# EasyEDA Pro project ProProject_Tautek_ESP32S3_2024-01-15.epro, schematic Schematic2
Create Date: 2024-01-02; Page Name: P1; Project Name: Tautek_ESP32S3; Schematic Name: Schematic2; Update Date: 2024-01-14; Company: EasyEDA.com; Drawed: EasyEDA Pro; Page Size: A4; Part Number: JLCPCB-002; Reviewed: EasyEDA Pro; Version: V0.1
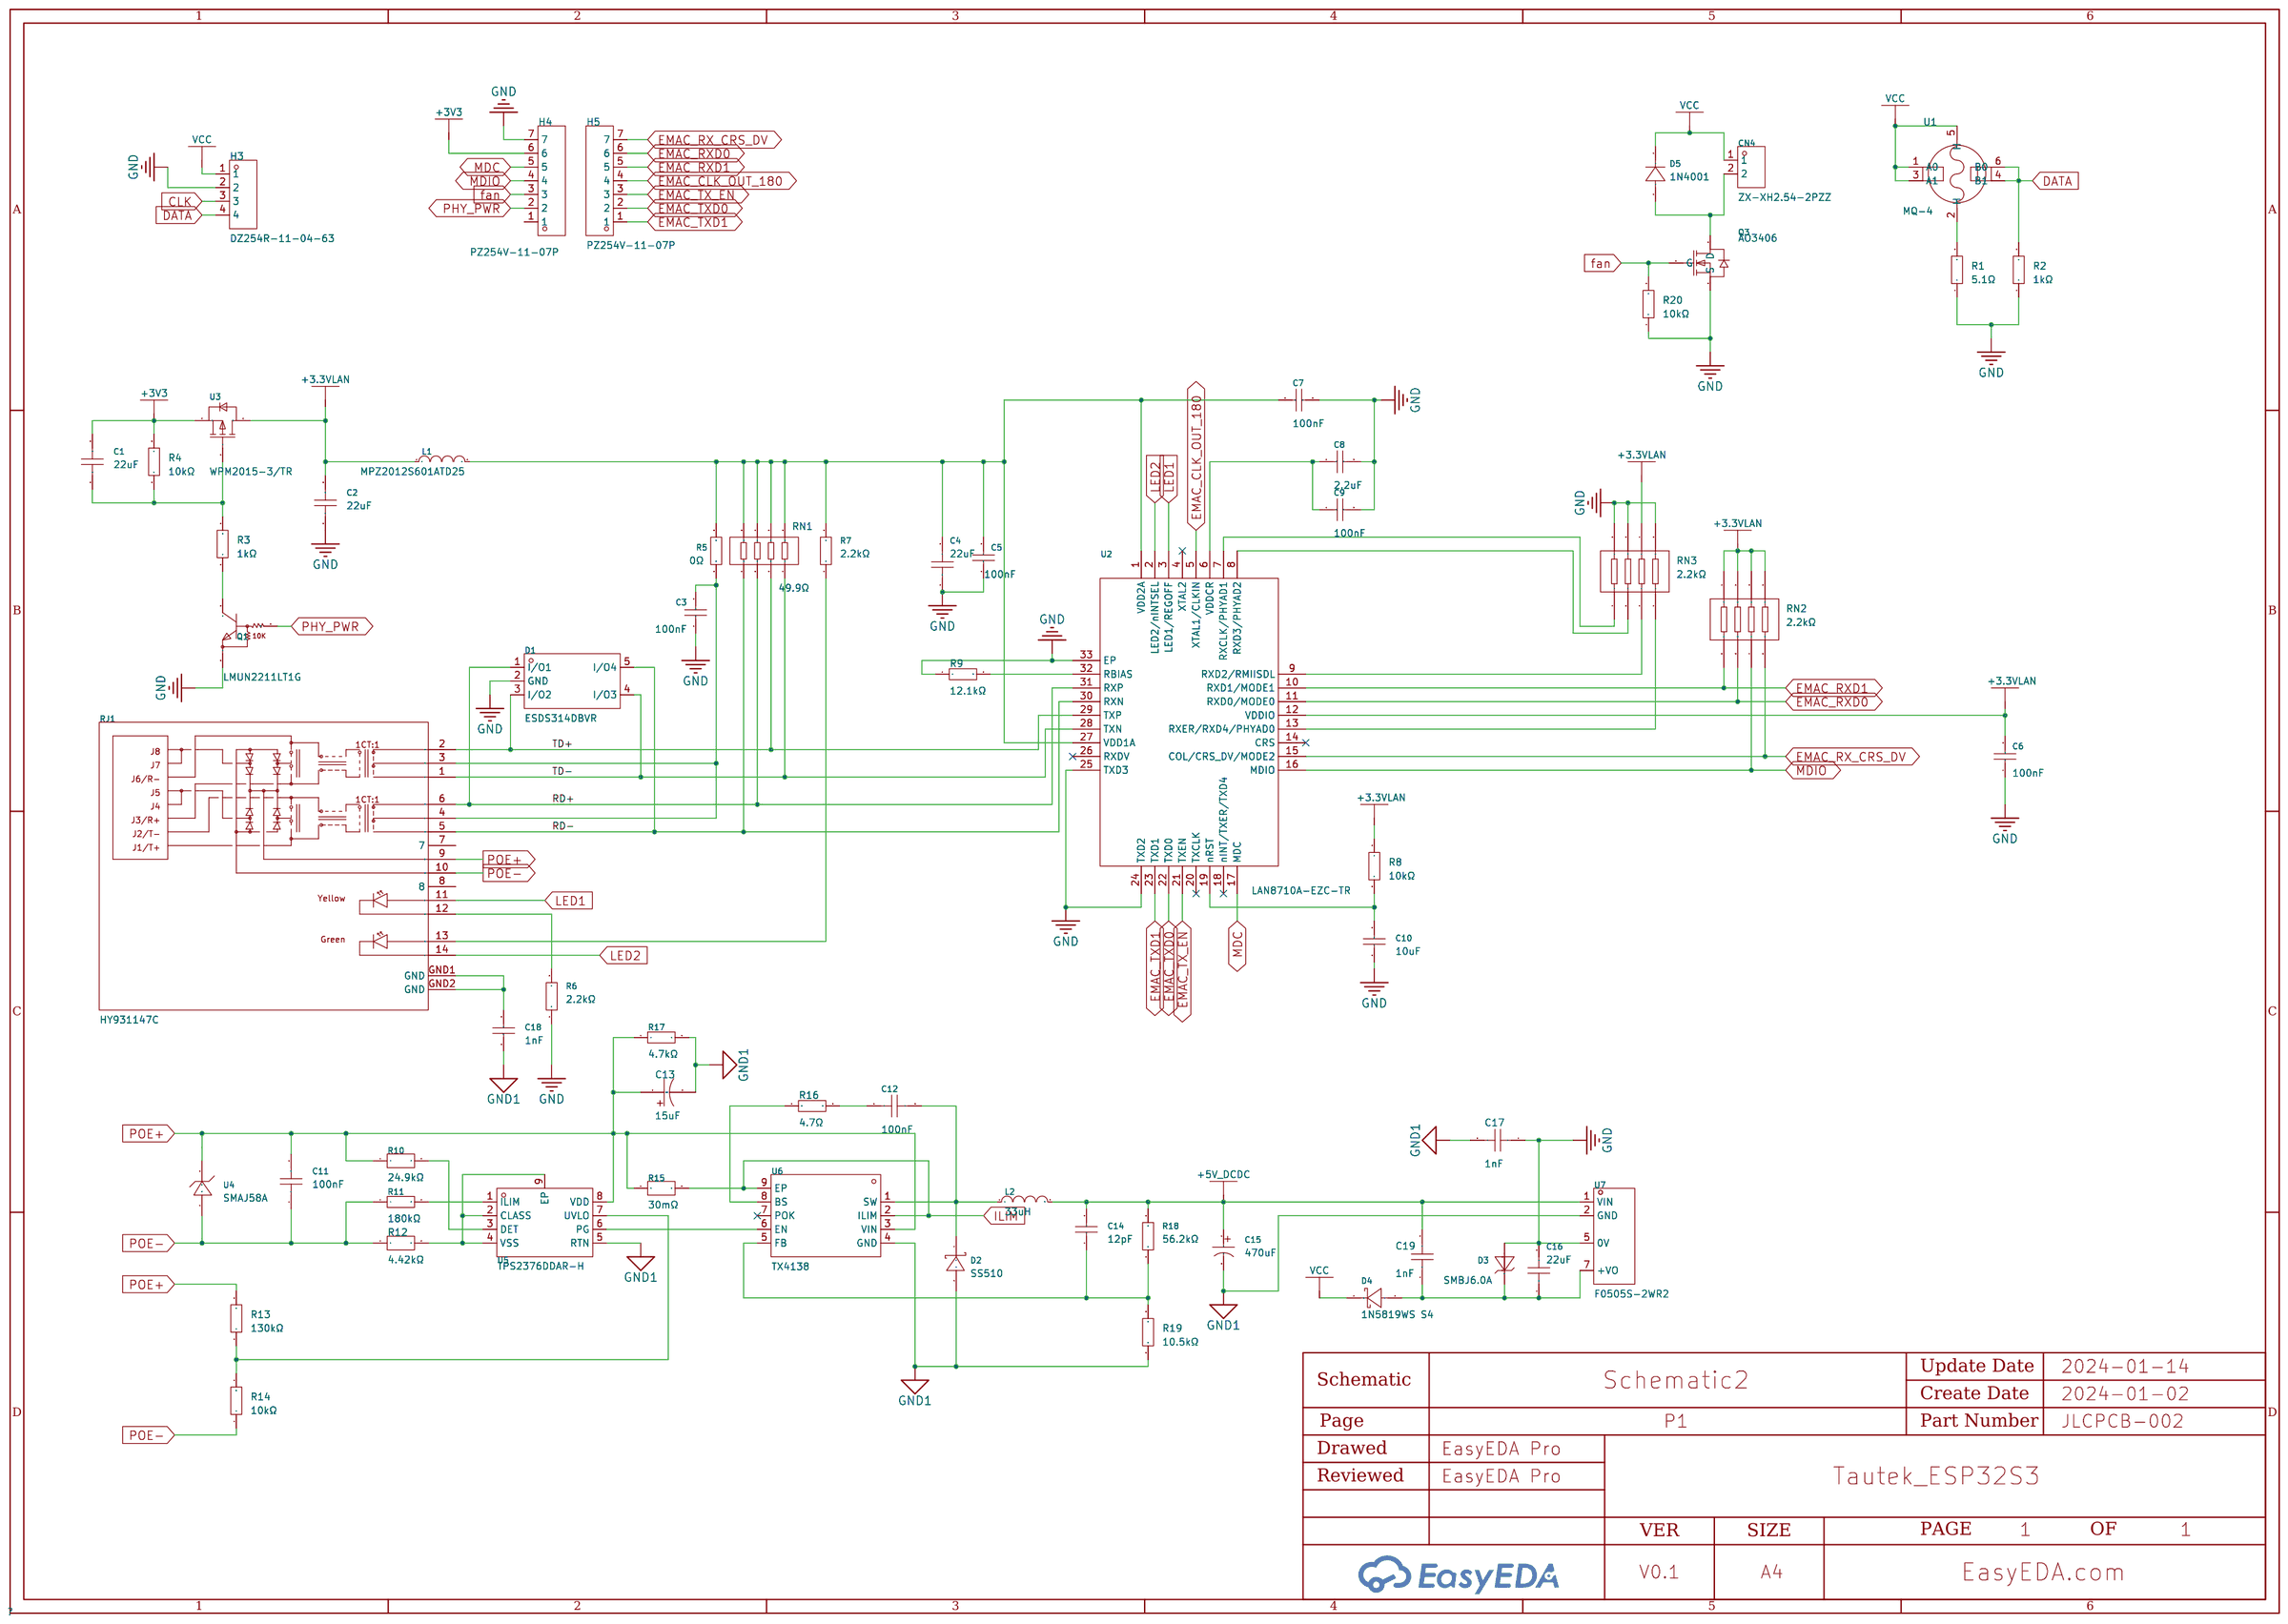
[diagram p0: schematic sheet]

## Parts
C1  22uF  [C0603]
C2  22uF  [C0603]
C3  100nF  [C0402]
C4  22uF  [C0603]
C5  100nF  [C0402]
C6  100nF  [C0402]
C7  100nF  [C0402]
C8  2.2uF  [C0603]
C9  100nF  [C0402]
C10  10uF  [C0402]
C11  100nF  [C0603]
C12  100nF  [C0603]
C13  15uF  [CAP-TH_BD5.0-P2.00-D0.8-FD]
C14  12pF  [C0402]
C15  470uF  [CAP-TH_BD6.3-P2.50-D1.0-FD]
C16  22uF  [C0603]
C17  1nF  [C1808]
C18  1nF  [C1206]
C19  1nF  [C1808]
CN4  ZX-XH2.54-2PZZ  [CONN-TH_2P-P2.50_HX25003-2A]
D1  ESDS314DBVR  [SOT-23-5_L2.9-W1.6-P0.95-LS2.8-BL]
D2  SS510  [SMA_L4.3-W2.6-LS5.2-RD]
D3  SMBJ6.0A  [SMB_L4.5-W3.7-LS5.4-RD]
D4  1N5819WS S4  [SOD-323_L1.6-W1.3-LS2.7-RD]
D5  1N4001  [SMA_L4.3-W2.5-LS5.0-RD]
H3  DZ254R-11-04-63  [HDR-TH_4P-P2.54-V-M]
H4  PZ254V-11-07P  [HDR-TH_7P-P2.54-V-M]
H5  PZ254V-11-07P  [HDR-TH_7P-P2.54-V-M]
L1  MPZ2012S601ATD25  [L0805]
L2  33uH  [IND-SMD_L8.0-W8.0]
Q1  LMUN2211LT1G  [SOT-23-3_L2.9-W1.3-P1.90-LS2.4-BR]
Q3  AO3406  [SOT-23-3L_L2.9-W1.6-P1.90-LS2.8-BL]
R1  5.1Ω  [R0805]
R2  1kΩ  [R0603]
R3  1kΩ  [R0402]
R4  10kΩ  [R0402]
R5  0Ω  [R0402]
R6  2.2kΩ  [R0402]
R7  2.2kΩ  [R0402]
R8  10kΩ  [R0402]
R9  12.1kΩ  [R0402]
R10  24.9kΩ  [R0603]
R11  180kΩ  [R0603]
R12  4.42kΩ  [R0603]
R13  130kΩ  [R0603]
R14  10kΩ  [R0603]
R15  30mΩ  [R1206]
R16  4.7Ω  [R0402]
R17  4.7kΩ  [R2512]
R18  56.2kΩ  [R0402]
R19  10.5kΩ  [R0402]
R20  10kΩ  [R0402]
RJ1  HY931147C  [RJ45-TH_HY931147C]
RN1  49.9Ω  [RES-ARRAY-SMD_0603-8P-L3.2-W1.6-BL]
RN2  2.2kΩ  [RES-ARRAY-SMD_8P-L3.2-W1.6-P0.80-BL-2]
RN3  2.2kΩ  [RES-ARRAY-SMD_8P-L3.2-W1.6-P0.80-BL-2]
U1  MQ-4  [SENSOR-TH_MQ-4]
U2  LAN8710A-EZC-TR  [QFN-32_L5.0-W5.0-P0.50-BL-EP3.4]
U3  WPM2015-3/TR  [SOT-23-3_L2.9-W1.3-P1.90-LS2.4-BR]
U4  SMAJ58A  [SMA_L4.3-W2.7-LS5.0-RD]
U5  TPS2376DDAR-H  [SO-8_L4.9-W3.9-P1.27-LS6.0-BL-EP]
U6  TX4138  [SOIC-8_L4.9-W3.9-P1.27-LS6.0-BL-EP]
U7  F0505S-2WR2  [PWRM-TH_FXXXXS-1WR2]

## Library data of the parts
C1 C2 C4 C16 = CL10A226MQ8NRNC: Capacitance: Tolerance:±20% Tolerance:±20% Voltage Rated: Temperature Coefficient:; LCSC Part Name: 22uF ±20% 6.3V; Supplier Part: C59461; Manufacturer: SAMSUNG(三星); Supplier Footprint: 0603; JLCPCB Part Class: Basic Part; Datasheet: https://atta.szlcsc.com/upload/public/pdf/source/20160218/1457707763339.pdf; Supplier: LCSC; Tolerance: ±20%
C3 C5-C7 C9 = CL05B104KO5NNNC: Capacitance: Tolerance:±10% Tolerance:±10% Voltage Rated: Temperature Coefficient:; LCSC Part Name: 100nF ±10% 16V; Supplier Part: C1525; Manufacturer: SAMSUNG(三星); Supplier Footprint: 0402; JLCPCB Part Class: Basic Part; Datasheet: https://atta.szlcsc.com/upload/public/pdf/source/20160218/1457707763339.pdf; Supplier: LCSC; Tolerance: ±10%
C8 = CL10A225KO8NNNC: Capacitance: Tolerance:±10% Tolerance:±10% Voltage Rated: Temperature Coefficient:; LCSC Part Name: 2.2uF ±10% 16V; Supplier Part: C23630; Manufacturer: SAMSUNG(三星); Supplier Footprint: 0603; JLCPCB Part Class: Basic Part; Datasheet: https://atta.szlcsc.com/upload/public/pdf/source/20160218/1457707763339.pdf; Supplier: LCSC; Tolerance: ±10%
C10 = CL05A106MQ5NUNC: Capacitance: Tolerance:±20% Tolerance:±20% Voltage Rated: Temperature Coefficient:; LCSC Part Name: 10uF ±20% 6.3V; Supplier Part: C15525; Manufacturer: SAMSUNG(三星); Supplier Footprint: 0402; JLCPCB Part Class: Basic Part; Datasheet: https://atta.szlcsc.com/upload/public/pdf/source/20220823/2B02EE04F8F211D38A52DCB16EB6BEBA.pdf; Supplier: LCSC; Tolerance: ±20%
C11 = CL10B104KC8NNNC: Capacitance: Tolerance:±10% Tolerance:±10% Voltage Rated: Temperature Coefficient:; LCSC Part Name: 100nF ±10% 100V; Supplier Part: C15725; Manufacturer: SAMSUNG(三星); Supplier Footprint: 0603; JLCPCB Part Class: Extended Part; Datasheet: https://atta.szlcsc.com/upload/public/pdf/source/20160218/1457707763339.pdf; Supplier: LCSC; Tolerance: ±10%
C12 = AC0603KRX7R0BB104: Capacitance: Tolerance:±10% Tolerance:±10% Voltage Rated: Temperature Coefficient:; LCSC Part Name: 100nF ±10% 100V; Supplier Part: C408909; Manufacturer: YAGEO(国巨); Supplier Footprint: 0603; JLCPCB Part Class: Extended Part; Datasheet: https://atta.szlcsc.com/upload/public/pdf/source/20190807/C408909_08D926EAD6CFF180A2920270A6C9C818.pdf; Supplier: LCSC; Tolerance: ±10%
C13 = LKMB1102A150MF: Capacitance: Tolerance:±20% Tolerance:±20% Rated Voltage: φD: L: Lead Spacing: Ripple Current:267mA@100kHz Equivalent Series Resistance(ESR):- Lifetime @ Temp:7000hrs@105℃; LCSC Part Name: 15uF ±20% 100V; Supplier Part: C443117; Manufacturer: Ymin(永铭); Supplier Footprint: 插件,D5xL11mm; JLCPCB Part Class: Extended Part; Datasheet: https://atta.szlcsc.com/upload/public/pdf/source/20191107/C443117_345849A2C5892D7759BB73F011F8AA70.pdf; Supplier: LCSC; Tolerance: ±20%; Ripple Current: 267mA@100kHz; Lifetime @ Temp: 7000hrs@105℃
C14 = GRM1555C1H120JA01D: Capacitance: Tolerance:±5% Tolerance:±5% Voltage Rated: Temperature Coefficient:; LCSC Part Name: 12pF ±5% 50V; Supplier Part: C76948; Manufacturer: muRata(村田); Supplier Footprint: 0402; JLCPCB Part Class: Extended Part; Datasheet: https://atta.szlcsc.com/upload/public/pdf/source/20180307/C76948_15204091175261407736.pdf; Supplier: LCSC; Tolerance: ±5%
C15 = KM477M010E11RR0VH2FP0: Capacitance: Tolerance:±20% Tolerance:±20% Rated Voltage: φD: L: Lead Spacing: Lifetime @ Temp:1000hrs@105℃; LCSC Part Name: 470uF ±20% 10V; Supplier Part: C43326; Manufacturer: CX(承兴); Supplier Footprint: 插件,D6.3xL11mm; JLCPCB Part Class: Extended Part; Datasheet: https://atta.szlcsc.com/upload/public/pdf/source/20211027/06D6BA3719C264B639DC286D935D03EA.pdf; Supplier: LCSC; Tolerance: ±20%; Lifetime @ Temp: 1000hrs@105℃
C17 C19 = 302R29W102KV4E: Capacitance: Tolerance:±10% Tolerance:±10% Voltage Rated: Temperature Coefficient:; LCSC Part Name: 1nF ±10% 3kV; Supplier Part: C173224; Manufacturer: JOHANSON(约翰逊); Supplier Footprint: 1808; JLCPCB Part Class: Extended Part; Datasheet: https://atta.szlcsc.com/upload/public/pdf/source/20190909/C173224_EDDECDD913CC2D53A62E7AE6E78D1950.pdf; Supplier: LCSC; Tolerance: ±10%
C18 = CC1206KKX7RDBB102: Capacitance: Tolerance:±10% Tolerance:±10% Voltage Rated: Temperature Coefficient:; LCSC Part Name: 1nF ±10% 2kV; Supplier Part: C23631; Manufacturer: YAGEO(国巨); Supplier Footprint: 1206; JLCPCB Part Class: Extended Part; Datasheet: https://atta.szlcsc.com/upload/public/pdf/source/20180910/C282080_BCE296114B59C3710FB69343383A5C6E.pdf; Supplier: LCSC; Tolerance: ±10%
CN4 = ZX-XH2.54-2PZZ: Pins Structure:1x2P Pitch:2.54mm Mounting Style:Straight Row Spacing:- Number of Pins:2P Number of Rows:1 Number of PINs Per Row:2 Reference Series:XH Current Rating (Max):3A Contact Material:Brass Contact Plating:Tin Operating Temperature Range:-25℃~+85℃; LCSC Part Name: 1x2P 间距:2.54mm 直插 系列:XH; Supplier Part: C7429632; Manufacturer: Megastar(兆星); Supplier Footprint: 插件,P=2.54mm; JLCPCB Part Class: Extended Part; Datasheet: https://atta.szlcsc.com/upload/public/pdf/source/20230619/19BA6947230AA44A04D3EDD65E618FD0.pdf; Supplier: LCSC; Pins Structure: 1x2P; Pitch: 2.54mm; Mounting Style: Straight; Number of Pins: 2P; Number of Rows: 1; Number of PINs Per Row: 2; Reference Series: XH; Current Rating (Max): 3A; Contact Material: Brass; Contact Plating: Tin; Operating Temperature Range: -25℃~+85℃
D1 = ESDS314DBVR: Supplier Part: C1847859; Manufacturer: TI(德州仪器); Supplier Footprint: SOT-23-5; JLCPCB Part Class: Extended Part; Datasheet: https://www.ti.com/cn/lit/gpn/esds314; Supplier: LCSC
D2 = SS510_C65010: Forward Voltage (Vf@If):850mV@5A Reverse Voltage (Vr):100V Average Rectified Current (Io):5A; LCSC Part Name: 电压:100V 电流:5A; Supplier Part: C65010; Manufacturer: MDD; Supplier Footprint: SMA(DO-214AC); JLCPCB Part Class: Extended Part; Datasheet: https://atta.szlcsc.com/upload/public/pdf/source/20230314/529CD85F9B31F69841D3A079BC07E377.pdf; Supplier: LCSC; Forward Voltage (Vf@If): 850mV@5A; Reverse Voltage (Vr): 100V; Average Rectified Current (Io): 5A
D3 = SMBJ6.0A_C908784: Reverse Stand-Off Voltage (Vrwm):6V Maximum Clamping Voltage:10.3V Peak Pulse Current (Ipp)@10/1000us:58.3A Breakdown Voltage:6.67V Reverse Leakage Current (Ir):800uA; Supplier Part: C908784; Manufacturer: GOODWORK(固得沃克); Supplier Footprint: SMB(DO-214AA); JLCPCB Part Class: Extended Part; Datasheet: https://atta.szlcsc.com/upload/public/pdf/source/20201231/C908783_5F0AE07776753216FC0A4122EEBBB8E2.pdf; Supplier: LCSC; Reverse Stand-Off Voltage (Vrwm): 6V; Maximum Clamping Voltage: 10.3V; Peak Pulse Current (Ipp)@10/1000us: 58.3A; Breakdown Voltage: 6.67V; Reverse Leakage Current (Ir): 800uA
D4 = 1N5819WS S4_C2927280: Diode Configuration:Single Forward Voltage (Vf@If):600mV@200mA Reverse Voltage (Vr):40V Average Rectified Current (Io):350mA Reverse Leakage Current (Ir):5uA@30V; LCSC Part Name: 电压:40V 电流:350mA; Supplier Part: C2927280; Manufacturer: JSMSEMI(杰盛微); Supplier Footprint: SOD-323; JLCPCB Part Class: Extended Part; Datasheet: https://atta.szlcsc.com/upload/public/pdf/source/20211230/020DF3ABCB41CBA5E28580D63AFB2CA3.pdf; Supplier: LCSC; Diode Configuration: Single; Forward Voltage (Vf@If): 600mV@200mA; Reverse Voltage (Vr): 40V; Average Rectified Current (Io): 350mA; Reverse Leakage Current (Ir): 5uA@30V
D5 = 1N4001_C727079: Diode Configuration: Forward Voltage (Vf@If):1.1V@1A Reverse Voltage (Vr): Average Rectified Current (Io): Reverse Leakage Current:5uA@50V; LCSC Part Name: 电压:50V 电流:1A; Supplier Part: C727079; Manufacturer: TWGMC(台湾迪嘉); Supplier Footprint: SMA(DO-214AC); JLCPCB Part Class: Extended Part; Datasheet: https://atta.szlcsc.com/upload/public/pdf/source/20200828/C727079_3A05254382567072883400655AE0ED46.pdf; Supplier: LCSC; Forward Voltage (Vf@If): 1.1V@1A; Reverse Leakage Current: 5uA@50V
H3 = DZ254R-11-04-63: Number of Rows:Plugin Number of Pins:4P Pitch:2.54mm Pin Structure:1x4P Row Spacing:- Mounting Type:Straight Circluar Pins/Square Pins:Square Pins Current Rating (Max):3A Voltage Rating (Max):- Length of Mating Pin:6mm Insulation Height:2.54mm Length of E; LCSC Part Name: 2.54mm 1x4P 直插 方针; Supplier Part: C2935910; Manufacturer: DEALON(德艺隆); Supplier Footprint: 插件,P=2.54mm; JLCPCB Part Class: Extended Part; Datasheet: https://atta.szlcsc.com/upload/public/pdf/source/20211231/575FA3133C71038A037ABECAE7869EE6.pdf; Supplier: LCSC; Number of Rows: Plugin; Number of Pins: 4P; Pitch: 2.54mm; Pin Structure: 1x4P; Mounting Type: Straight; Circluar Pins/Square Pins: Square Pins; Current Rating (Max): 3A; Length of Mating Pin: 6mm; Insulation Height: 2.54mm; Length of End Connection Pin: 3mm
H4 H5 = PZ254V-11-07P: Number of Rows:Plugin Number of Pins:7P Pitch:2.54mm Pin Structure:1x7P Row Spacing:- Mounting Type:Straight Circluar Pins/Square Pins:Square Pins Current Rating (Max):- Voltage Rating (Max):- Length of Mating Pin:6mm Insulation Height:2.5mm Length of End; LCSC Part Name: 2.54mm 1x7P 直插 方针; Supplier Part: C492406; Manufacturer: XFCN(兴飞); Supplier Footprint: 插件,P=2.54mm; JLCPCB Part Class: Extended Part; Datasheet: https://atta.szlcsc.com/upload/public/pdf/source/20200309/C492406_654C533EE691117E22DD9F76C114C2D9.pdf; Supplier: LCSC; Number of Rows: Plugin; Number of Pins: 7P; Pitch: 2.54mm; Pin Structure: 1x7P; Mounting Type: Straight; Circluar Pins/Square Pins: Square Pins; Length of Mating Pin: 6mm; Insulation Height: 2.5mm; Length of End Connection Pin: 3mm; Operating Temperature Range: -40℃~+105℃; Color: Black
L1 = MPZ2012S601ATD25: Impedance @ Frequency:600Ω@100MHz Tolerance:±25% Tolerance:±25% DC Resistance:100mΩ Current Rating:2A Circuits:1; LCSC Part Name: 单路 0805磁珠 阻抗600Ω@100MHz; Supplier Part: C81034; Manufacturer: TDK; Supplier Footprint: 0805; JLCPCB Part Class: Extended Part; Datasheet: https://atta.szlcsc.com/upload/public/pdf/source/20180613/C81034_2FD391D3901DD38A3F2C22B18566951A.pdf; Supplier: LCSC; Impedance @ Frequency: 600Ω@100MHz; Tolerance: ±25%; DC Resistance: 100mΩ; Current Rating: 2A; Circuits: 1
L2 = HPC8040NF-330M: Inductance: Tolerance:±20% Tolerance:±20% Rated Current: DC Resistance (DCR):; LCSC Part Name: 33uH ±20%; Supplier Part: C357084; Manufacturer: TAI-TECH(台庆); Supplier Footprint: SMD; JLCPCB Part Class: Extended Part; Datasheet: https://atta.szlcsc.com/upload/public/pdf/source/20200917/C357084_D822CFB55683CCA480E447E6A4B098EC.pdf; Supplier: LCSC; Tolerance: ±20%
Q1 = LMUN2211LT1G: Power Dissipation (Pd):246mW Collector-Emitter Breakdown Voltage (Vceo):50V Transistor Type:1个NPN-预偏置 Collector Current (Ic):100mA; LCSC Part Name: 电流:100mA 耐压:50V; Supplier Part: C12775; Manufacturer: LRC(乐山无线电); Supplier Footprint: SOT-23; JLCPCB Part Class: Extended Part; Datasheet: https://atta.szlcsc.com/upload/public/pdf/source/20130524/1457706604539.pdf; Supplier: LCSC; Power Dissipation (Pd): 246mW; Collector-Emitter Breakdown Voltage (Vceo): 50V; Transistor Type: 1个NPN-预偏置; Collector Current (Ic): 100mA
Q3 = AO3406: Type: Drain Source Voltage (Vdss): Continuous Drain Current (Id): Power Dissipation (Pd): Drain Source On Resistance (RDS(on)@Vgs,Id):40mΩ@10V,3.5A Gate Threshold Voltage (Vgs(th)@Id):3V@250uA Total Gate Charge (Qg@Vgs):3nC@4.5V Input Capacitance (Ciss@Vd; LCSC Part Name: N沟道 耐压:30V 电流:3.5A; Supplier Part: C2909910; Manufacturer: KUU; Supplier Footprint: SOT-23-3L; JLCPCB Part Class: Extended Part; Datasheet: https://atta.szlcsc.com/upload/public/pdf/source/20211028/0E3B3988D844BD6EE10576588A9F97BD.pdf; Supplier: LCSC; Drain Source On Resistance (RDS(on)@Vgs,Id): 40mΩ@10V,3.5A; Gate Threshold Voltage (Vgs(th)@Id): 3V@250uA; Total Gate Charge (Qg@Vgs): 3nC@4.5V; Input Capacitance (Ciss@Vds): 305pF@15V; Reverse Transfer Capacitance (Crss@Vds): 29pF@15V
R1 = RC0805FR-075R1L: Tolerance: Temperature Coefficient: Temperature Coefficient: Resistance: Power(Watts): Overload Voltage (Max): Operating Temperature Range: Operating Temperature Range:; LCSC Part Name: 5.1Ω ±1%; Supplier Part: C114539; Manufacturer: YAGEO(国巨); Supplier Footprint: 0805; JLCPCB Part Class: Extended Part; Datasheet: https://atta.szlcsc.com/upload/public/pdf/source/20170912/C114539_1505207773912963414.pdf; Supplier: LCSC
R2 = RC0603FR-071KL: Type:Thick Film Resistors Resistance: Tolerance:±1% Tolerance:±1% Power(Watts): Temperature Coefficient:±100ppm/℃ Temperature Coefficient:±100ppm/℃ Overload Voltage (Max): Operating Temperature Range:-55℃~+155℃ Operating Temperature Range:-55℃~+155℃; LCSC Part Name: 1kΩ ±1% 100mW; Supplier Part: C22548; Manufacturer: YAGEO(国巨); Supplier Footprint: 0603; JLCPCB Part Class: Extended Part; Datasheet: https://atta.szlcsc.com/upload/public/pdf/source/20180312/7BD3618A8B6324EA6280B0497A051AB7.pdf; Supplier: LCSC; Type: Thick Film Resistors; Tolerance: ±1%; Temperature Coefficient: ±100ppm/℃; Operating Temperature Range: -55℃~+155℃
R3 = RC0402FR-071KL: Type:Thick Film Resistors Resistance: Tolerance:±1% Tolerance:±1% Power(Watts): Temperature Coefficient:±100ppm/℃ Temperature Coefficient:±100ppm/℃ Overload Voltage (Max): Operating Temperature Range:-55℃~+155℃ Operating Temperature Range:-55℃~+155℃; LCSC Part Name: 1kΩ ±1% 62.5mW; Supplier Part: C106235; Manufacturer: YAGEO(国巨); Supplier Footprint: 0402; JLCPCB Part Class: Extended Part; Datasheet: https://atta.szlcsc.com/upload/public/pdf/source/20170518/1495085714666.pdf; Supplier: LCSC; Type: Thick Film Resistors; Tolerance: ±1%; Temperature Coefficient: ±100ppm/℃; Operating Temperature Range: -55℃~+155℃
R4 R8 R20 = RC0402FR-0710KL: Type:Thick Film Resistors Resistance: Tolerance:±1% Tolerance:±1% Power(Watts): Temperature Coefficient:±100ppm/℃ Temperature Coefficient:±100ppm/℃ Overload Voltage (Max): Operating Temperature Range:-55℃~+155℃ Operating Temperature Range:-55℃~+155℃; LCSC Part Name: 10kΩ ±1% 62.5mW; Supplier Part: C60490; Manufacturer: YAGEO(国巨); Supplier Footprint: 0402; JLCPCB Part Class: Extended Part; Datasheet: https://atta.szlcsc.com/upload/public/pdf/source/20170606/1496716515432.pdf; Supplier: LCSC; Type: Thick Film Resistors; Tolerance: ±1%; Temperature Coefficient: ±100ppm/℃; Operating Temperature Range: -55℃~+155℃
R5 = 0402WGF0000TCE: Resistance: Tolerance:±1% Tolerance:±1% Power(Watts): Overload Voltage (Max): Temperature Coefficient:±800ppm/℃ Temperature Coefficient:±800ppm/℃ Type:Thick Film Resistors Operating Temperature Range:-55℃~+155℃ Operating Temperature Range:-55℃~+155℃; LCSC Part Name: 0Ω ±1% 62.5mW 厚膜电阻; Supplier Part: C17168; Manufacturer: UNI-ROYAL(厚声); Supplier Footprint: 0402; JLCPCB Part Class: Basic Part; Datasheet: https://atta.szlcsc.com/upload/public/pdf/source/20200306/C422600_1E6D84923E4A46A82E41ADD87F860B5C.pdf; Supplier: LCSC; Tolerance: ±1%; Temperature Coefficient: ±800ppm/℃; Type: Thick Film Resistors; Operating Temperature Range: -55℃~+155℃
R6 R7 = RC0402FR-072K2L: Type:Thick Film Resistors Resistance: Tolerance:±1% Tolerance:±1% Power(Watts): Temperature Coefficient:±100ppm/℃ Temperature Coefficient:±100ppm/℃ Overload Voltage (Max): Operating Temperature Range:-55℃~+155℃ Operating Temperature Range:-55℃~+155℃; LCSC Part Name: 厚膜电阻 2.2kΩ ±1% 62.5mW; Supplier Part: C114762; Manufacturer: YAGEO(国巨); Supplier Footprint: 0402; JLCPCB Part Class: Extended Part; Datasheet: https://atta.szlcsc.com/upload/public/pdf/source/20180821/C275644_0D56F95EFF785E7D9A1FEF436B37DA78.pdf; Supplier: LCSC; Type: Thick Film Resistors; Tolerance: ±1%; Temperature Coefficient: ±100ppm/℃; Operating Temperature Range: -55℃~+155℃
R9 = RC0402FR-0712K1L: Type:Thick Film Resistors Resistance: Tolerance:±1% Tolerance:±1% Power(Watts): Temperature Coefficient:±100ppm/℃ Temperature Coefficient:±100ppm/℃ Overload Voltage (Max): Operating Temperature Range:-55℃~+155℃ Operating Temperature Range:-55℃~+155℃; LCSC Part Name: 厚膜电阻 12.1kΩ ±1% 62.5mW; Supplier Part: C132157; Manufacturer: YAGEO(国巨); Supplier Footprint: 0402; JLCPCB Part Class: Extended Part; Datasheet: https://atta.szlcsc.com/upload/public/pdf/source/20180207/C132157_15179947979061359023.pdf; Supplier: LCSC; Type: Thick Film Resistors; Tolerance: ±1%; Temperature Coefficient: ±100ppm/℃; Operating Temperature Range: -55℃~+155℃
R10 = PTFR0603B24K9N9: Type:Thin Film Resistor Resistance: Power(Watts): Overload Voltage (Max): Temperature Coefficient:±10ppm/℃ Temperature Coefficient:±10ppm/℃ Tolerance:±0.1% Tolerance:±0.1% Operating Temperature Range:-55℃~+125℃ Operating Temperature Range:-55℃~+125℃; LCSC Part Name: 薄膜电阻 24.9kΩ ±0.1% 100mW; Supplier Part: C2692729; Manufacturer: RESI(开步睿思）; Supplier Footprint: 0603; JLCPCB Part Class: Extended Part; Datasheet: https://atta.szlcsc.com/upload/public/pdf/source/20231020/37F75D505DFC5CA75CC16B0F0ECD8764.pdf; Supplier: LCSC; Type: Thin Film Resistor; Temperature Coefficient: ±10ppm/℃; Tolerance: ±0.1%; Operating Temperature Range: -55℃~+125℃
R11 = PTFR0603B180KP9: Type:Thin Film Resistor Resistance: Power(Watts): Overload Voltage (Max): Temperature Coefficient:±25ppm/℃ Temperature Coefficient:±25ppm/℃ Tolerance:±0.1% Tolerance:±0.1% Operating Temperature Range:-55℃~+125℃ Operating Temperature Range:-55℃~+125℃; LCSC Part Name: 薄膜电阻 180kΩ ±0.1% 100mW; Supplier Part: C351677; Manufacturer: RESI(开步睿思）; Supplier Footprint: 0603; JLCPCB Part Class: Extended Part; Datasheet: https://atta.szlcsc.com/upload/public/pdf/source/20231020/37F75D505DFC5CA75CC16B0F0ECD8764.pdf; Supplier: LCSC; Type: Thin Film Resistor; Temperature Coefficient: ±25ppm/℃; Tolerance: ±0.1%; Operating Temperature Range: -55℃~+125℃
R12 = RC0603FR-074K42L: Type:Thick Film Resistors Resistance: Tolerance:±1% Tolerance:±1% Power(Watts): Temperature Coefficient:±100ppm/℃ Temperature Coefficient:±100ppm/℃ Overload Voltage (Max): Operating Temperature Range:-55℃~+155℃ Operating Temperature Range:-55℃~+155℃; LCSC Part Name: 4.42kΩ ±1% 100mW; Supplier Part: C482858; Manufacturer: YAGEO(国巨); Supplier Footprint: 0603; JLCPCB Part Class: Extended Part; Datasheet: https://atta.szlcsc.com/upload/public/pdf/source/20200715/C482858_96E268C4D2FCC19A4EBAFEEA49725A55.pdf; Supplier: LCSC; Type: Thick Film Resistors; Tolerance: ±1%; Temperature Coefficient: ±100ppm/℃; Operating Temperature Range: -55℃~+155℃
R13 = RC0603FR-07130KL: Type:Thick Film Resistors Resistance: Tolerance:±1% Tolerance:±1% Power(Watts): Temperature Coefficient:±100ppm/℃ Temperature Coefficient:±100ppm/℃ Overload Voltage (Max): Operating Temperature Range:-55℃~+155℃ Operating Temperature Range:-55℃~+155℃; LCSC Part Name: 130kΩ ±1% 100mW; Supplier Part: C163432; Manufacturer: YAGEO(国巨); Supplier Footprint: 0603; JLCPCB Part Class: Extended Part; Datasheet: https://atta.szlcsc.com/upload/public/pdf/source/20180111/C163432_15156544276051258953.pdf; Supplier: LCSC; Type: Thick Film Resistors; Tolerance: ±1%; Temperature Coefficient: ±100ppm/℃; Operating Temperature Range: -55℃~+155℃
R14 = RC0603FR-0710KL: Type:Thick Film Resistors Resistance: Tolerance:±1% Tolerance:±1% Power(Watts): Temperature Coefficient:±100ppm/℃ Temperature Coefficient:±100ppm/℃ Overload Voltage (Max): Operating Temperature Range:-55℃~+155℃ Operating Temperature Range:-55℃~+155℃; LCSC Part Name: 10kΩ ±1% 100mW; Supplier Part: C98220; Manufacturer: YAGEO(国巨); Supplier Footprint: 0603; JLCPCB Part Class: Extended Part; Datasheet: https://atta.szlcsc.com/upload/public/pdf/source/20170522/1495423494387.pdf; Supplier: LCSC; Type: Thick Film Resistors; Tolerance: ±1%; Temperature Coefficient: ±100ppm/℃; Operating Temperature Range: -55℃~+155℃
R15 = 1206W3F300MT5E: Resistance:30mΩ Tolerance:±1% Tolerance:±1% Power(Watts): Overload Voltage (Max): Type:Thick Film Resistors Operating Temperature Range:-55℃~+155℃ Operating Temperature Range:-55℃~+155℃; LCSC Part Name: 30mΩ ±1% 333.333mW 厚膜电阻; Supplier Part: C473665; Manufacturer: UNI-ROYAL(厚声); Supplier Footprint: 1206; JLCPCB Part Class: Extended Part; Datasheet: https://atta.szlcsc.com/upload/public/pdf/source/20200306/C422600_1E6D84923E4A46A82E41ADD87F860B5C.pdf; Supplier: LCSC; Tolerance: ±1%; Type: Thick Film Resistors; Operating Temperature Range: -55℃~+155℃
R16 = RC-02U4R70FT: Resistance: Tolerance:±1% Tolerance:±1% Power(Watts): Temperature Coefficient:±400ppm/℃ Temperature Coefficient:±400ppm/℃ Overload Voltage (Max): Operating Temperature Range:-55℃~+155℃ Operating Temperature Range:-55℃~+155℃; LCSC Part Name: 4.7Ω ±1% 62.5mW; Supplier Part: C140156; Manufacturer: FH(风华); Supplier Footprint: 0402; JLCPCB Part Class: Extended Part; Datasheet: https://atta.szlcsc.com/upload/public/pdf/source/20140616/1457707091974.pdf; Supplier: LCSC; Tolerance: ±1%; Temperature Coefficient: ±400ppm/℃; Operating Temperature Range: -55℃~+155℃
R17 = RMC25124.7K1%N: Resistance: Tolerance:1% Tolerance:1% Power(Watts):; LCSC Part Name: 4.7kΩ 1% 1W; Supplier Part: C269368; Manufacturer: Tyohm(幸亚电阻); Supplier Footprint: 2512; JLCPCB Part Class: Extended Part; Datasheet: https://atta.szlcsc.com/upload/public/pdf/source/20190115/C325956_D27151D492FFB3C9AB4A6F14FE01F30A.pdf; Supplier: LCSC; Tolerance: 1%
R18 = RC0402FR-0756K2L: Type:Thick Film Resistors Resistance: Tolerance:±1% Tolerance:±1% Power(Watts): Overload Voltage (Max): Temperature Coefficient:±100ppm/℃ Temperature Coefficient:±100ppm/℃ Operating Temperature Range:-55℃~+155℃ Operating Temperature Range:-55℃~+155℃; LCSC Part Name: 厚膜电阻 56.2kΩ ±1% 62.5mW; Supplier Part: C183355; Manufacturer: YAGEO(国巨); Supplier Footprint: 0402; JLCPCB Part Class: Extended Part; Datasheet: https://atta.szlcsc.com/upload/public/pdf/source/20180904/C276339_014E484F1DBA106FB92D45EABD5A1AC1.pdf; Supplier: LCSC; Type: Thick Film Resistors; Tolerance: ±1%; Temperature Coefficient: ±100ppm/℃; Operating Temperature Range: -55℃~+155℃
R19 = RC0402FR-0710K5L: Type:Thick Film Resistors Resistance: Tolerance:±1% Tolerance:±1% Power(Watts): Temperature Coefficient:±100ppm/℃ Temperature Coefficient:±100ppm/℃ Overload Voltage (Max): Operating Temperature Range:-55℃~+155℃ Operating Temperature Range:-55℃~+155℃; LCSC Part Name: 10.5kΩ ±1% 62.5mW; Supplier Part: C171695; Manufacturer: YAGEO(国巨); Supplier Footprint: 0402; JLCPCB Part Class: Extended Part; Datasheet: https://atta.szlcsc.com/upload/public/pdf/source/20180115/C171695_15159960317631267619.pdf; Supplier: LCSC; Type: Thick Film Resistors; Tolerance: ±1%; Temperature Coefficient: ±100ppm/℃; Operating Temperature Range: -55℃~+155℃
RJ1 = HY931147C: Connector Type:RJReceptacle USOC Codes:RJ45 Number of Ports:1 Ratings:- Shielding:- LED:WithLED; LCSC Part Name: RJ45 带LED; Supplier Part: C91754; Manufacturer: HANRUN(汉仁); Supplier Footprint: 插件; JLCPCB Part Class: Extended Part; Datasheet: https://atta.szlcsc.com/upload/public/pdf/source/20170214/1487040199459.pdf; Supplier: LCSC; Connector Type: RJReceptacle; USOC Codes: RJ45; Number of Ports: 1; LED: WithLED
RN1 = RTA03-4D49R9FTP: Resistance: Tolerance:±1% Tolerance:±1% Power(Watts): Number of Resistors: Number of Pins: Temperature Coefficient:±200ppm/℃ Temperature Coefficient:±200ppm/℃; LCSC Part Name: 49.9Ω ±1%; Supplier Part: C102675; Manufacturer: RALEC(旺诠); Supplier Footprint: 0603x4; JLCPCB Part Class: Extended Part; Datasheet: https://atta.szlcsc.com/upload/public/pdf/source/20170408/1491642563995.pdf; Supplier: LCSC; Tolerance: ±1%; Temperature Coefficient: ±200ppm/℃
RN2 RN3 = WA06X222JTL: Resistance: Tolerance:±5% Tolerance:±5% Power(Watts): Number of Resistors: Number of Pins: Temperature Coefficient:±200ppm/℃ Temperature Coefficient:±200ppm/℃; LCSC Part Name: 2.2kΩ ±5% 0603x4; Supplier Part: C168190; Manufacturer: Walsin(华新科); Supplier Footprint: 0603x4; JLCPCB Part Class: Extended Part; Datasheet: https://atta.szlcsc.com/upload/public/pdf/source/20180115/C168190_15159956895971267006.pdf; Supplier: LCSC; Tolerance: ±5%; Temperature Coefficient: ±200ppm/℃
U1 = MQ-4: Supplier Part: C99756; Manufacturer: Winsen(炜盛); Supplier Footprint: 插件; JLCPCB Part Class: Extended Part; Datasheet: https://atta.szlcsc.com/upload/public/pdf/source/20170327/1490588065885.pdf; Supplier: LCSC
U2 = LAN8710A-EZC-TR: Application Function:Transceiver Number of Channels: Interface:； Supply Voltage:1.6V~3.6V Supply Voltage:1.6V~3.6V Operating Temperature:0℃~+85℃ Operating Temperature:0℃~+85℃; LCSC Part Name: MII/RMII 10/100以太网收发器与HP Auto-MDIX; Supplier Part: C46185; Manufacturer: MICROCHIP(美国微芯); Supplier Footprint: QFN-32-EP(5x5); JLCPCB Part Class: Extended Part; Datasheet: https://atta.szlcsc.com/upload/public/pdf/source/20150407/1457707276411.pdf; Supplier: LCSC; Application Function: Transceiver; Interface: ；; Supply Voltage: 1.6V~3.6V; Operating Temperature: 0℃~+85℃
U3 = WPM2015-3/TR_C6562215: Type: Drain Source Voltage (Vdss):20V Continuous Drain Current (Id): Power Dissipation (Pd): Drain Source On Resistance (RDS(on)@Vgs,Id):110mΩ@4.5V,2.7A Gate Threshold Voltage (Vgs(th)@Id):1V@250uA Input Capacitance (Ciss@Vds):534pF@10V Reverse Transfer C; LCSC Part Name: P沟道 耐压:20V 电流:2.4A; Supplier Part: C6562215; Manufacturer: KUU; Supplier Footprint: SOT-23-3; JLCPCB Part Class: Extended Part; Datasheet: https://atta.szlcsc.com/upload/public/pdf/source/20230606/6542D1091BAB08D3FFB9FC253D2CAEA2.pdf; Supplier: LCSC; Drain Source Voltage (Vdss): 20V; Drain Source On Resistance (RDS(on)@Vgs,Id): 110mΩ@4.5V,2.7A; Gate Threshold Voltage (Vgs(th)@Id): 1V@250uA; Input Capacitance (Ciss@Vds): 534pF@10V; Reverse Transfer Capacitance (Crss@Vds): 54pF@10V
U4 = SMAJ58A_C2980408: Reverse Stand-Off Voltage (Vrwm):58V Maximum Clamping Voltage:93.6V Peak Pulse Current (Ipp)@10/1000us:4.3A Peak Pulse Power Dissipation (Ppp)@10/1000us:400W Breakdown Voltage:64.4V Reverse Leakage Current (Ir):5uA; LCSC Part Name: 单向TVS 58V截止 4.3A峰值脉冲; Supplier Part: C2980408; Manufacturer: GOODWORK(固得沃克); Supplier Footprint: SMA(DO-214AC); JLCPCB Part Class: Extended Part; Datasheet: https://atta.szlcsc.com/upload/public/pdf/source/20220309/E032B40D2905BED446DFB1EE3B8664F1.pdf; Supplier: LCSC; Reverse Stand-Off Voltage (Vrwm): 58V; Maximum Clamping Voltage: 93.6V; Peak Pulse Current (Ipp)@10/1000us: 4.3A; Peak Pulse Power Dissipation (Ppp)@10/1000us: 400W; Breakdown Voltage: 64.4V; Reverse Leakage Current (Ir): 5uA
U5 = TPS2376DDAR-H: Type:PDController Supply Voltage:0V~57V Supply Voltage:0V~57V Maximum Power:12.95W number of channels:1 Operating Temperature:-40℃~+85℃ Operating Temperature:-40℃~+85℃; LCSC Part Name: 符合IEEE802.3af 标准并能提供600mA电流的PD控制器; Supplier Part: C544899; Manufacturer: TI(德州仪器); Supplier Footprint: SO-8; JLCPCB Part Class: Extended Part; Datasheet: https://www.ti.com/cn/lit/gpn/tps2376-h; Supplier: LCSC; Type: PDController; Supply Voltage: 0V~57V; Maximum Power: 12.95W; number of channels: 1; Operating Temperature: -40℃~+85℃
U6 = TX4138: Function:Step-down type Input Voltage:- Input Voltage:- Output Current (Max):- Switching Frequency:- Synchronous Rectification:- Number of Outputs:- Topology:-; LCSC Part Name: 3级(168小时); Supplier Part: C329267; Manufacturer: XDS(芯鼎盛); Supplier Footprint: SOIC-8-EP; JLCPCB Part Class: Extended Part; Datasheet: https://atta.szlcsc.com/upload/public/pdf/source/20181114/C329267_989D7B149BAECCF600512AEB0395E303.pdf; Supplier: LCSC; Function: Step-down type
U7 = F0505S-2WR2: Conversion Type:DC-DC Function:- Input Voltage(DC):4.5V~5.5V Input Voltage(DC):4.5V~5.5V Output Voltage:5V Output Voltage:5V Output Current (Max):400mA Output Current (Max):400mA Output Channel:1; Supplier Part: C909777; Manufacturer: DEXU(德旭电子); Supplier Footprint: 插件; JLCPCB Part Class: Extended Part; Datasheet: https://atta.szlcsc.com/upload/public/pdf/source/20220506/11F4803FDD0EE0BCAC344A94E448D374.pdf; Supplier: LCSC; Conversion Type: DC-DC; Input Voltage(DC): 4.5V~5.5V; Output Voltage: 5V; Output Current (Max): 400mA; Output Channel: 1

## Nets
+3.3VLAN: C2.2 C6.2 L1.1 R8.1 RN2.1 RN2.2 RN2.3 RN2.4 RN3.7 U2.12(VDDIO) U3.3(D)
+3V3: C1.2 H4.6 R4.2 U3.2(S)
+5V_DCDC: C14.2 C15.1 C19.2 L2.2 R18.2 U7.1(VIN)
GND: C2.1 C3.1 C4.1 C5.1 C6.1 C7.2 C8.2 C9.2 C10.1 C16.2 C17.1 D1.2(GND) D3.2 H3.2 H4.7 Q1.2(E) Q3.2(S) R1.1 R2.1 R6.1 R9.1 R20.1 RN3.5 RN3.6 RN3.8 U2.24(TXD2) U2.25(TXD3) U2.33(EP) U7.5(0V)
GND1: C13.2 C15.2 C17.2 C18.1 D2.2(A) R17.2 R19.1 U5.5(RTN) U6.4(GND) U7.2(GND)
VCC: CN4.1 D4.1(C) D5.1(K) H3.1 U1.1(A0) U1.3(A1) U1.5(H)
CLK: H3.3
DATA: H3.4 R2.2 U1.4(B1) U1.6(B0)
EMAC_CLK_OUT_180: H5.4 U2.5(XTAL1/CLKIN)
EMAC_RX_CRS_DV: H5.7 RN2.8 U2.15(COL/CRS_DV/MODE2)
EMAC_RXD0: H5.6 RN2.6 U2.11(RXD0/MODE0)
EMAC_RXD1: H5.5 RN2.5 U2.10(RXD1/MODE1)
EMAC_TX_EN: H5.3 U2.21(TXEN)
EMAC_TXD0: H5.2 U2.22(TXD0)
EMAC_TXD1: H5.1 U2.23(TXD1)
fan: H4.3 Q3.1(G) R20.2
ILIM: R15.2 U6.2(ILIM) U6.9(EP)
LED1: RJ1.11 U2.3(LED1/REGOFF)
LED2: RJ1.14 U2.2(LED2/nINTSEL)
MDC: H4.5 U2.17(MDC)
MDIO: H4.4 RN2.7 U2.16(MDIO)
PHY_PWR: H4.2 Q1.1(B)
POE+: C11.2 C13.1 R10.1 R13.2 R15.1 R17.1 RJ1.9 U4.1 U5.8(VDD) U6.3(VIN)
POE-: C11.1 R11.1 R12.1 R14.1 RJ1.10 U4.2
RD+: D1.1(I/O1) RJ1.6 RN1.2 U2.31(RXP)
RD-: D1.5(I/O4) RJ1.5 RN1.1 U2.30(RXN)
TD+: D1.3(I/O2) RJ1.2 RN1.3 U2.29(TXP)
TD-: D1.4(I/O3) RJ1.1 RN1.4 U2.28(TXN)
$1N700: R1.2 U1.2(H)
$1N2202: C1.1 R3.2 R4.1 U3.1(G)
$1N2225: Q1.3(C) R3.1
$1N3053: C3.2 R5.1 RJ1.3 RJ1.4
$1N3553: C8.1 C9.1 U2.6(VDDCR)
$1N3828: R6.2 RJ1.12
$1N3966: C4.2 C5.2 C7.1 L1.2 R5.2 R7.2 RN1.5 RN1.6 RN1.7 RN1.8 U2.1(VDD2A) U2.27(VDD1A)
$1N4011: R7.1 RJ1.13
$1N4990: C10.2 R8.2 U2.19(nRST)
$1N5106: R9.2 U2.32(RBIAS)
$1N5698: R11.2 U5.1(ILIM)
$1N5818: R10.2 U5.3(DET)
$1N5842: R12.2 U5.2(CLASS) U5.4(VSS) U5.9(EP)
$1N6036: R13.1 R14.2 U5.7(UVLO)
$1N6047: U5.6(PG) U6.6(EN)
$1N7959: C12.2 D2.1(K) L2.1 U6.1(SW)
$1N7966: C12.1 R16.2
$1N7969: R16.1 U6.8(BS)
$1N8334: C14.1 R18.1 R19.2 U6.5(FB)
$1N9216: C18.2 RJ1.GND1(GND) RJ1.GND2(GND)
$1N13735: C16.1 C19.1 D3.1 D4.2(A) U7.7(+VO)
$1N21641: RN3.4 U2.7(RXCLK/PHYAD1)
$1N21648: RN3.3 U2.8(RXD3/PHYAD2)
$1N21654: RN3.2 U2.9(RXD2/RMIISDL)
$1N21658: RN3.1 U2.13(RXER/RXD4/PHYAD0)
$1N29376: CN4.2 D5.2(A) Q3.3(D)

Not connected (* = marked no-connect by the designer): H4 1; RJ1 7 8; U2 4(XTAL2)* 14(CRS)* 18(nINT/TXER/TXD4)* 20(TXCLK)* 26(RXDV)*; U6 7(POK)*
